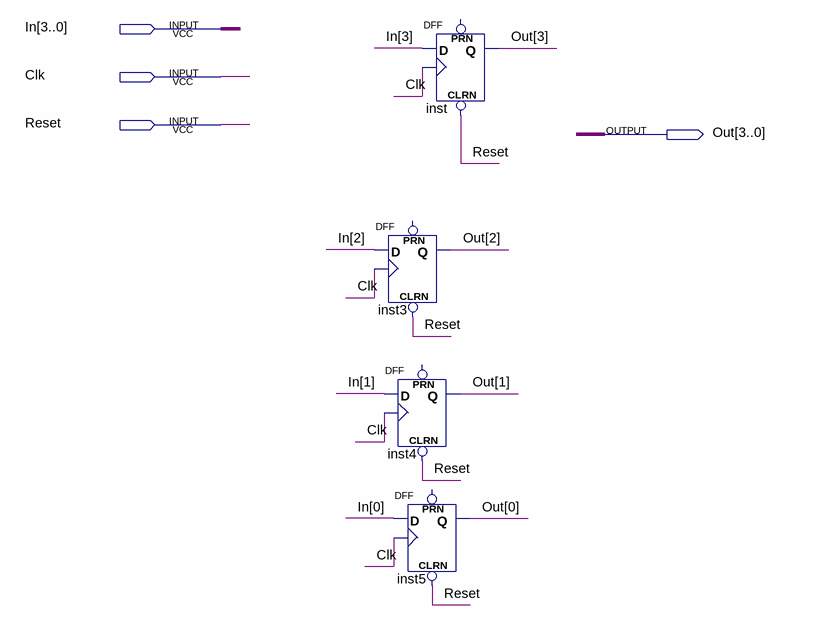
[diagram p0: schematic sheet]
// Quartus schematic Reg_4bit.bdf as structural Verilog: 4 symbols, 4 pins
module Reg_4bit (
  input  [3:0] In,
  input  Clk,
  input  Reset,
  output [3:0] Out
);

  DFF inst (.CLRN(Reset), .CLK(Clk), .D(In[3]), .Q(Out[3]));  // open: PRN
  DFF inst3 (.CLRN(Reset), .CLK(Clk), .D(In[2]), .Q(Out[2]));  // open: PRN
  DFF inst4 (.CLRN(Reset), .CLK(Clk), .D(In[1]), .Q(Out[1]));  // open: PRN
  DFF inst5 (.CLRN(Reset), .CLK(Clk), .D(In[0]), .Q(Out[0]));  // open: PRN
endmodule
